# Altium schematic sheet aruna_pcb_card.SchDoc
size 330 x 241 mm; SheetNumber: 1; SheetTotal: 1
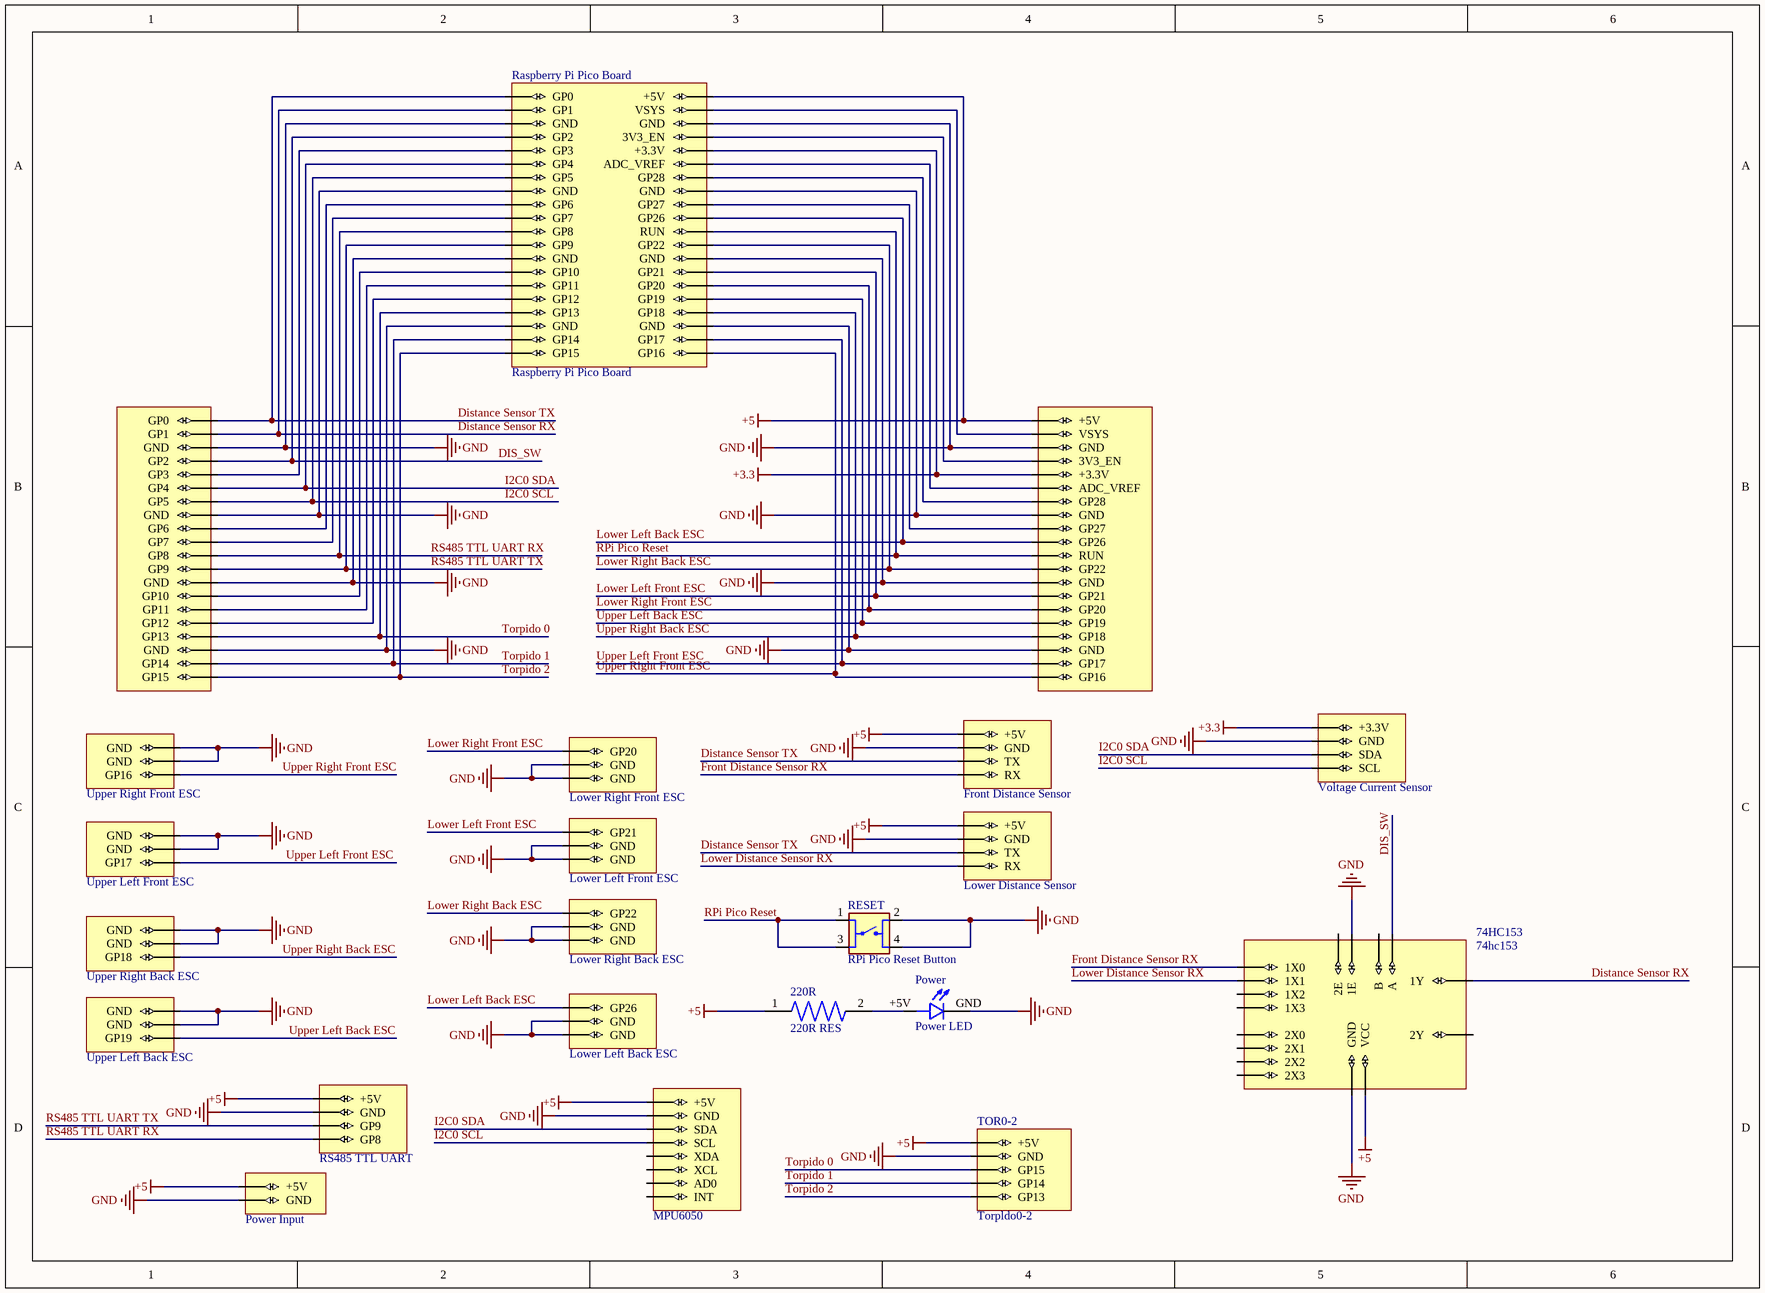
[diagram p0: aruna_pcb_card.SchDoc]

## Parts
74HC153  74hc153  [74HC153]
220R  220R RES  [RES]
Front_Distance_Sensor  Front Distance Sensor  [Front Distance Sensor]
Lower_Distance_Sensor  Lower Distance Sensor  [Lower Distance Sensor]
Lower_Left_Back_ESC  Lower Left Back ESC  [Lower Left Back ESC]
Lower_Left_Front_ESC  Lower Left Front ESC  [Lower Left Front ESC]
Lower_Right_Back_ESC  Lower Right Back ESC  [Lower Right Back ESC]
Lower_Right_Front_ESC  Lower Right Front ESC  [Lower Right Front ESC]
MPU6050  MPU6050  [MPU6050]
Power  Power LED  [POWER LED]
Power_Input  Power Input  [Power Input]
Raspberry_Pi_Pico_Board  Raspberry Pi Pico Board  [RASPBERRY PI PICO BOARD]
Raspberry_Pi_Pico_Board_Left  Raspberry Pi Pico Board Left  [Raspberry Pi Pico Board Left]  (value not drawn)
Raspberry_Pi_Pico_Board_Right  Raspberry Pi Pico Board Right  [Raspberry Pi Pico Board Right]  (value not drawn)
RESET  RPi Pico Reset Button  [RPI PICO RESET BUTTON]
RS485_TTL_UART  RS485 TTL UART  [RS485 TTL UART]
TOR0-2  Torpldo0-2  [Torpido0-2]
Upper_Left_Back_ESC  Upper Left Back ESC  [Upper Left Back ESC]
Upper_Left_Front_ESC  Upper Left Front ESC  [Upper Left Front ESC]
Upper_Right_Back_ESC  Upper Right Back ESC  [Upper Right Back ESC]
Upper_Right_Front_ESC  Upper Right Front ESC  [Upper Right Front ESC]
V/C_Sensor  Voltage Current Sensor  [Voltage Current Sensor]

## Nets
+3.3: Raspberry_Pi_Pico_Board.+3.3V Raspberry_Pi_Pico_Board_Right.+3.3V V/C_Sensor.+3.3V
+5: 74HC153.+5V(VCC) 220R.1 Front_Distance_Sensor.+5V Lower_Distance_Sensor.+5V MPU6050.+5V Power_Input.+5V Raspberry_Pi_Pico_Board.+5V Raspberry_Pi_Pico_Board_Right.+5V RS485_TTL_UART.+5V TOR0-2.+5V
GND: 74HC153.1E 74HC153.GND Front_Distance_Sensor.GND Lower_Distance_Sensor.GND Lower_Left_Back_ESC.GND Lower_Left_Front_ESC.GND Lower_Right_Back_ESC.GND Lower_Right_Front_ESC.GND MPU6050.GND Power.GND(-) Power_Input.GND Raspberry_Pi_Pico_Board.GND Raspberry_Pi_Pico_Board_Left.GND Raspberry_Pi_Pico_Board_Right.GND RESET.2 RESET.4 RS485_TTL_UART.GND TOR0-2.GND Upper_Left_Back_ESC.GND Upper_Left_Front_ESC.GND Upper_Right_Back_ESC.GND Upper_Right_Front_ESC.GND V/C_Sensor.GND
DIS_SW: 74HC153.A Raspberry_Pi_Pico_Board.GP2 Raspberry_Pi_Pico_Board_Left.GP2
Distance Sensor RX: 74HC153.1Y Raspberry_Pi_Pico_Board.GP1 Raspberry_Pi_Pico_Board_Left.GP1
Distance Sensor TX: Front_Distance_Sensor.TX Lower_Distance_Sensor.TX Raspberry_Pi_Pico_Board.GP0 Raspberry_Pi_Pico_Board_Left.GP0
Front Distance Sensor RX: 74HC153.1X0 Front_Distance_Sensor.RX
I2C0 SCL: MPU6050.SCL Raspberry_Pi_Pico_Board.GP5 Raspberry_Pi_Pico_Board_Left.GP5 V/C_Sensor.SCL
I2C0 SDA: MPU6050.SDA Raspberry_Pi_Pico_Board.GP4 Raspberry_Pi_Pico_Board_Left.GP4 V/C_Sensor.SDA
Lower Distance Sensor RX: 74HC153.1X1 Lower_Distance_Sensor.RX
Lower Left Back ESC: Lower_Left_Back_ESC.SIG(GP26) Raspberry_Pi_Pico_Board.GP26 Raspberry_Pi_Pico_Board_Right.GP26
Lower Left Front ESC: Lower_Left_Front_ESC.SIG(GP21) Raspberry_Pi_Pico_Board.GP21 Raspberry_Pi_Pico_Board_Right.GP21
Lower Right Back ESC: Lower_Right_Back_ESC.SIG(GP22) Raspberry_Pi_Pico_Board.GP22 Raspberry_Pi_Pico_Board_Right.GP22
Lower Right Front ESC: Lower_Right_Front_ESC.SIG(GP20) Raspberry_Pi_Pico_Board.GP20 Raspberry_Pi_Pico_Board_Right.GP20
RPi Pico Reset: Raspberry_Pi_Pico_Board.RUN Raspberry_Pi_Pico_Board_Right.RUN RESET.1 RESET.3
RS485 TTL UART RX: Raspberry_Pi_Pico_Board.GP8 Raspberry_Pi_Pico_Board_Left.GP8 RS485_TTL_UART.RX(GP8)
RS485 TTL UART TX: Raspberry_Pi_Pico_Board.GP9 Raspberry_Pi_Pico_Board_Left.GP9 RS485_TTL_UART.TX(GP9)
Torpido 0: Raspberry_Pi_Pico_Board.GP13 Raspberry_Pi_Pico_Board_Left.GP13 TOR0-2.IN0(GP15)
Torpido 1: Raspberry_Pi_Pico_Board.GP14 Raspberry_Pi_Pico_Board_Left.GP14 TOR0-2.IN1(GP14)
Torpido 2: Raspberry_Pi_Pico_Board.GP15 Raspberry_Pi_Pico_Board_Left.GP15 TOR0-2.IN2(GP13)
Upper Left Back ESC: Raspberry_Pi_Pico_Board.GP19 Raspberry_Pi_Pico_Board_Right.GP19 Upper_Left_Back_ESC.SIG(GP19)
Upper Left Front ESC: Raspberry_Pi_Pico_Board.GP17 Raspberry_Pi_Pico_Board_Right.GP17 Upper_Left_Front_ESC.SIG(GP17)
Upper Right Back ESC: Raspberry_Pi_Pico_Board.GP18 Raspberry_Pi_Pico_Board_Right.GP18 Upper_Right_Back_ESC.SIG(GP18)
Upper Right Front ESC: Raspberry_Pi_Pico_Board.GP16 Raspberry_Pi_Pico_Board_Right.GP16 Upper_Right_Front_ESC.SIG(GP16)
Net220R_2: 220R.2 Power.+5V(+)
NetRaspberry_Pi_Pico_Board_3V3_EN: Raspberry_Pi_Pico_Board.3V3_EN Raspberry_Pi_Pico_Board_Right.3V3_EN
NetRaspberry_Pi_Pico_Board_ADC_VREF: Raspberry_Pi_Pico_Board.ADC_VREF Raspberry_Pi_Pico_Board_Right.ADC_VREF
NetRaspberry_Pi_Pico_Board_GP3: Raspberry_Pi_Pico_Board.GP3 Raspberry_Pi_Pico_Board_Left.GP3
NetRaspberry_Pi_Pico_Board_GP6: Raspberry_Pi_Pico_Board.GP6 Raspberry_Pi_Pico_Board_Left.GP6
NetRaspberry_Pi_Pico_Board_GP7: Raspberry_Pi_Pico_Board.GP7 Raspberry_Pi_Pico_Board_Left.GP7
NetRaspberry_Pi_Pico_Board_GP10: Raspberry_Pi_Pico_Board.GP10 Raspberry_Pi_Pico_Board_Left.GP10
NetRaspberry_Pi_Pico_Board_GP11: Raspberry_Pi_Pico_Board.GP11 Raspberry_Pi_Pico_Board_Left.GP11
NetRaspberry_Pi_Pico_Board_GP12: Raspberry_Pi_Pico_Board.GP12 Raspberry_Pi_Pico_Board_Left.GP12
NetRaspberry_Pi_Pico_Board_GP27: Raspberry_Pi_Pico_Board.GP27 Raspberry_Pi_Pico_Board_Right.GP27
NetRaspberry_Pi_Pico_Board_GP28: Raspberry_Pi_Pico_Board.GP28 Raspberry_Pi_Pico_Board_Right.GP28
NetRaspberry_Pi_Pico_Board_VSYS: Raspberry_Pi_Pico_Board.VSYS Raspberry_Pi_Pico_Board_Right.VSYS

Not connected (* = marked no-connect by the designer): 74HC153 1X2 1X3 2E 2X0 2X1 2X2 2X3 2Y B; MPU6050 AD0 INT XCL XDA

## Library data of the parts
220R = 220R RES: MF: TE Connectivity; MP: 3-1623927-1; Price: None; SnapEDA_Link: https://www.snapeda.com/parts/3-1623927-1/TE+Connectivity/view-part/?ref=snap; Check_prices: https://www.snapeda.com/parts/3-1623927-1/TE+Connectivity/view-part/?ref=eda; Value: *; Package: None; Availability: In Stock
Power = Power LED: MP: TSAL6200; MF: Vishay; Price: None; SnapEDA_Link: https://www.snapeda.com/parts/TSAL6200/Vishay%20Semiconductor%20Opto%20Division/view-part/1186623/?ref=snap; Package: Radial Vishay; Availability: Unavailable; Value: *
RESET = RPi Pico Reset Button: MP: FSM8JH; MF: TE Connectivity; Check_prices: https://www.snapeda.com/parts/FSM8JH/TE+Connectivity+ALCOSWITCH+Switches/view-part/?ref=eda; Value: *; Availability: In Stock; Price: None; Package: None; SnapEDA_Link: https://www.snapeda.com/parts/FSM8JH/TE+Connectivity+ALCOSWITCH+Switches/view-part/?ref=snap